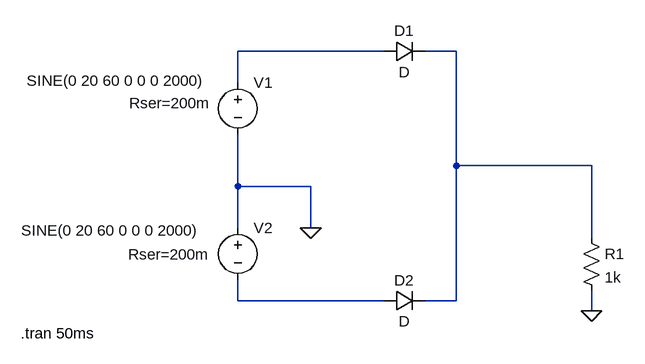
[diagram p0: schematic RectOndaCompleta.asc]
RectOndaCompleta.asc, the LTspice schematic file:
Version 4
SHEET 1 880 680
WIRE 384 -128 160 -128
WIRE 496 -128 448 -128
WIRE 160 -80 160 -128
WIRE 496 48 496 -128
WIRE 704 48 496 48
WIRE 160 80 160 0
WIRE 272 80 160 80
WIRE 160 144 160 80
WIRE 272 144 272 80
WIRE 704 160 704 48
WIRE 160 256 160 224
WIRE 384 256 160 256
WIRE 496 256 496 48
WIRE 496 256 448 256
WIRE 704 272 704 240
FLAG 272 144 0
FLAG 704 272 0
SYMBOL voltage 160 -96 R0
WINDOW 3 -325 13 Left 2
WINDOW 123 0 0 Left 0
WINDOW 39 -167 48 Left 2
SYMATTR InstName V1
SYMATTR Value SINE(0 20 60 0 0 0 2000)
SYMATTR SpiceLine Rser=200m
SYMBOL voltage 160 128 R0
WINDOW 3 -333 20 Left 2
WINDOW 123 0 0 Left 0
WINDOW 39 -169 57 Left 2
SYMATTR InstName V2
SYMATTR Value SINE(0 20 60 0 0 0 2000)
SYMATTR SpiceLine Rser=200m
SYMBOL diode 384 -112 R270
WINDOW 0 32 32 VTop 2
WINDOW 3 0 32 VBottom 2
SYMATTR InstName D1
SYMBOL diode 384 272 R270
WINDOW 0 32 32 VTop 2
WINDOW 3 0 32 VBottom 2
SYMATTR InstName D2
SYMBOL res 688 144 R0
SYMATTR InstName R1
SYMATTR Value 1k
TEXT -174 306 Left 2 !.tran 50ms

The netlist it stands for:
* RectOndaCompleta.asc
V1 N001 0 SINE(0 20 60 0 0 0 2000) Rser=200m
V2 0 N003 SINE(0 20 60 0 0 0 2000) Rser=200m
D1 N001 N002 D
D2 N003 N002 D
R1 N002 0 1k
.model D D
.lib standard.dio
.tran 50ms
.backanno
.end